# EAGLE schematic VS1053 hardware (EAGLE 9.3.2)
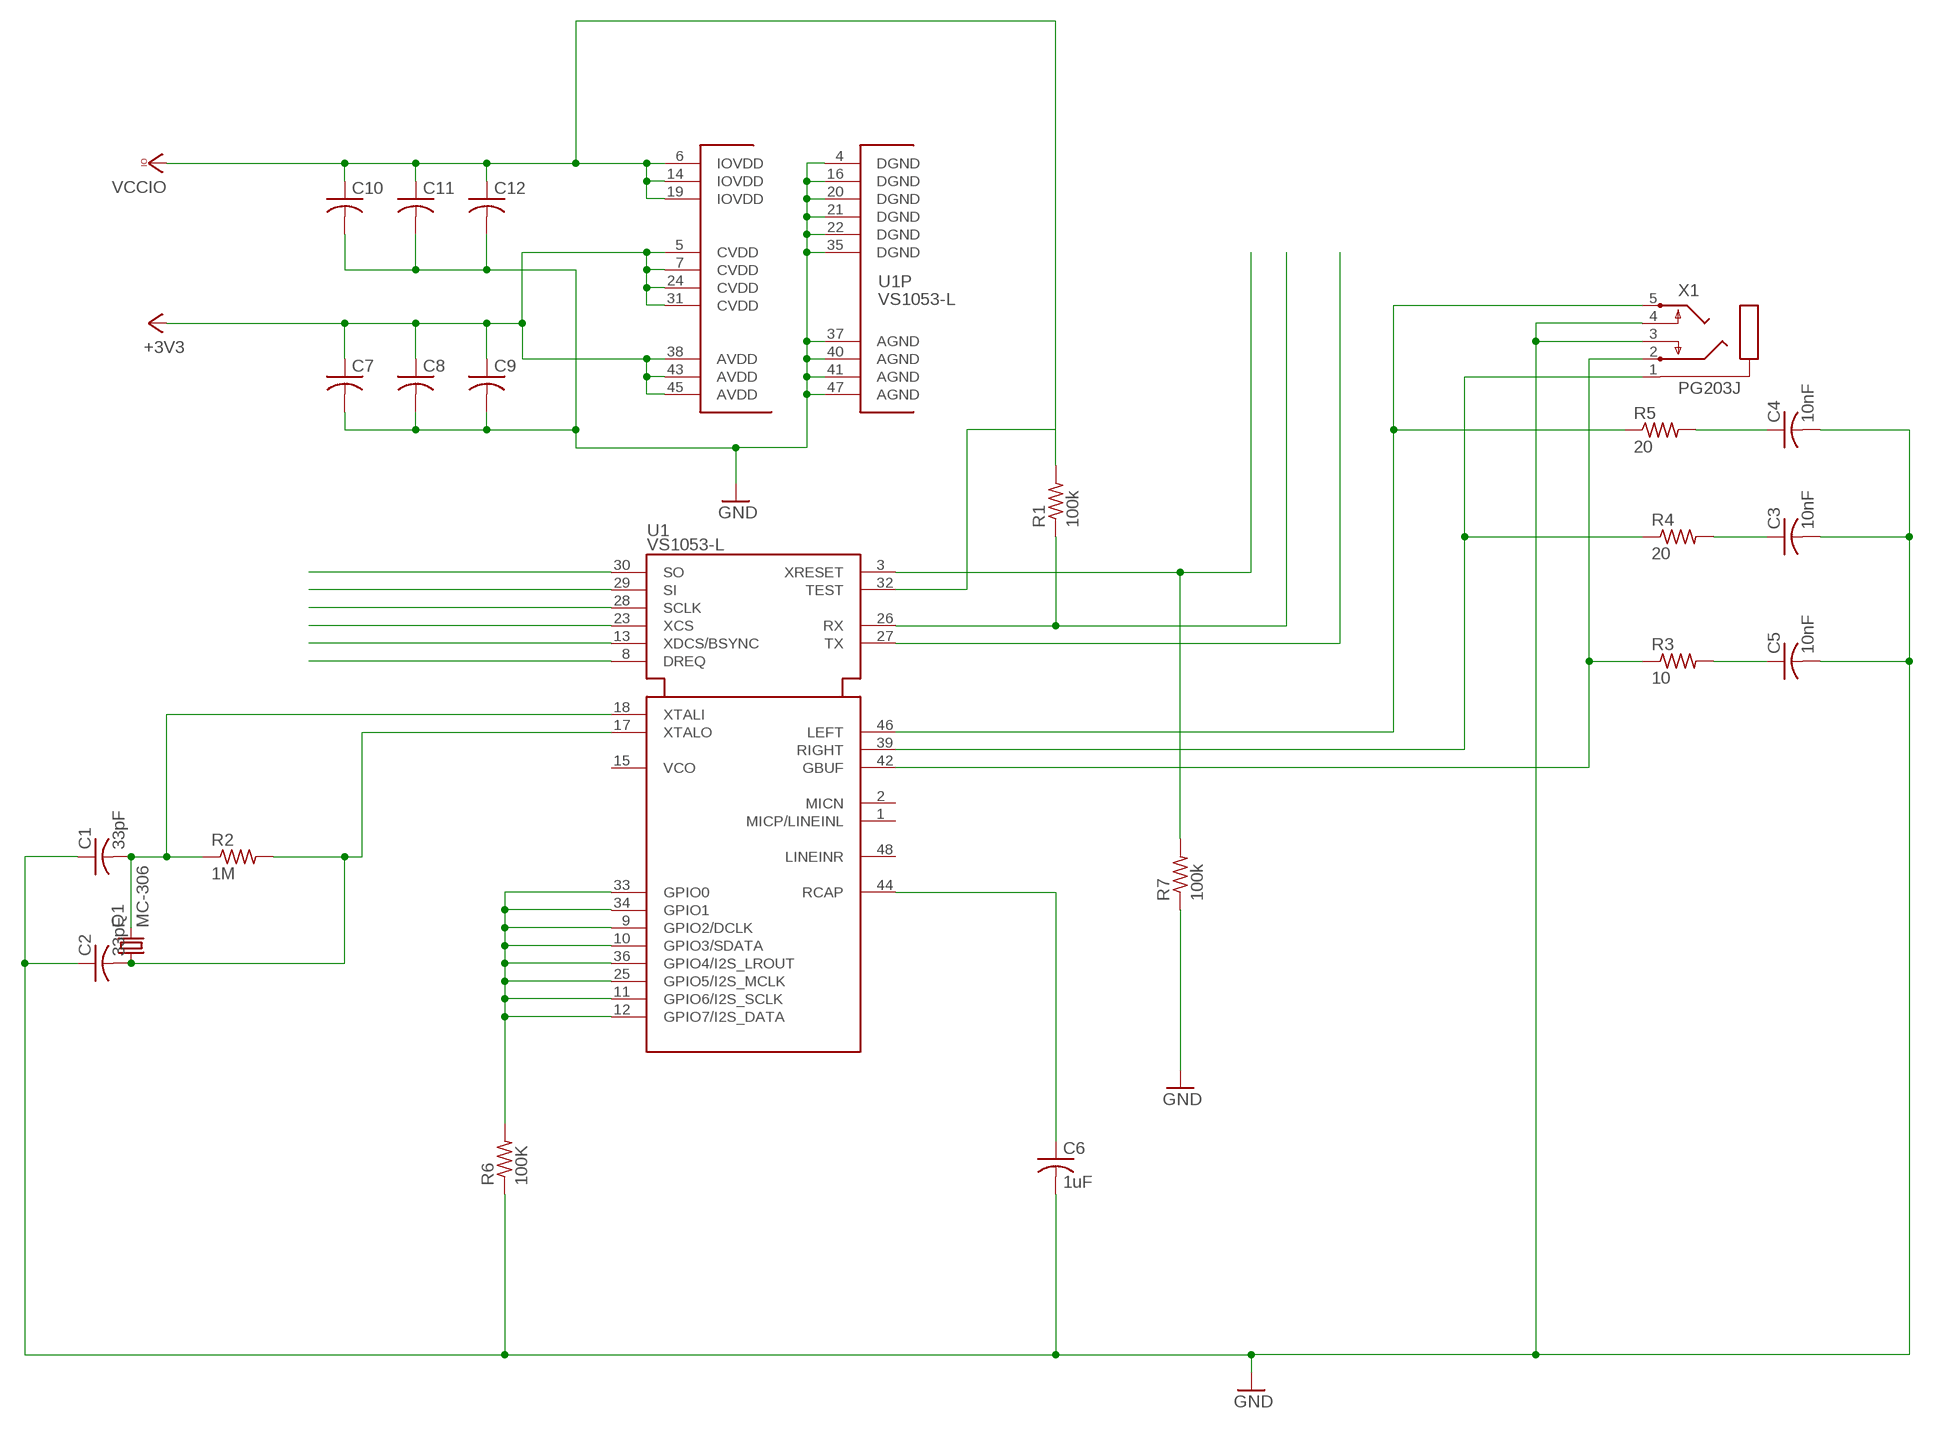
[diagram p0: schematic, sheet 1]

## Parts
C1  33pF  C-USC0402  [C0402]
C2  33pF  C-USC0402  [C0402]
C3  10nF  C-USC0201  [C0201]
C4  10nF  C-USC0201  [C0201]
C5  10nF  C-USC0201  [C0201]
C6  1uF  C-USC0201  [C0201]
C7  C-USC0504  [C0504]
C8  C-USC0504  [C0504]
C9  C-USC0504  [C0504]
C10  C-USC0504  [C0504]
C11  C-USC0504  [C0504]
C12  C-USC0504  [C0504]
Q1  MC-306  [MC-306]
R1  100k  R-US_M0805  [M0805]
R2  1M  R-US_1812X7R  [1812X7R]
R3  10  R-US_01005  [R01005]
R4  20  R-US_01005  [R01005]
R5  20  R-US_01005  [R01005]
R6  100K  R-US_M0805  [M0805]
R7  100k  R-US_M0805  [M0805]
U1  VS1053-L  [LQFP48]
X1  PG203J  [PG203J]

## Nets
+3V3: C7.1 C8.1 C9.1 U1.5(CVDD) U1.7(CVDD) U1.24(CVDD) U1.31(CVDD) U1.38(AVDD) U1.43(AVDD) U1.45(AVDD)
GND: C1.1 C2.1 C3.2 C4.2 C5.2 C6.2 C7.2 C8.2 C9.2 C10.2 C11.2 C12.2 R6.1 R7.1 U1.4(DGND) U1.16(DGND) U1.20(DGND) U1.21(DGND) U1.22(DGND) U1.35(DGND) U1.37(AGND) U1.40(AGND) U1.41(AGND) U1.47(AGND) X1.3 X1.4
N$1: C1.2 Q1.4 R2.1 U1.18(XTALI)
N$2: C2.2 Q1.1 R2.2 U1.17(XTALO)
N$3: C5.1 R3.2
N$4: C6.1 U1.44(RCAP)
N$5: R3.1 U1.42(GBUF) X1.2
N$6: R4.1 U1.39(RIGHT) X1.1
N$7: R5.1 U1.46(LEFT) X1.5
N$8: C3.1 R4.2
N$9: C4.1 R5.2
N$10: U1.28(SCLK)
N$11: R6.2 U1.9(GPIO2/DCLK) U1.10(GPIO3/SDATA) U1.11(GPIO6/I2S_SCLK) U1.12(GPIO7/I2S_DATA) U1.25(GPIO5/I2S_MCLK) U1.33(GPIO0) U1.34(GPIO1) U1.36(GPIO4/I2S_LROUT)
N$12: U1.23(XCS)
N$13: R1.1 U1.26(RX)
N$14: U1.13(XDCS/BSYNC)
N$15: R7.2 U1.3(XRESET)
N$16: U1.8(DREQ)
N$17: U1.30(SO)
N$18: U1.29(SI)
N$19: U1.27(TX)
VCCIO: C10.1 C11.1 C12.1 R1.2 U1.6(IOVDD) U1.14(IOVDD) U1.19(IOVDD) U1.32(TEST)
Unconnected: U1.1(MICP/LINEINL) U1.2(MICN) U1.15(VCO) U1.48(LINEINR)

## Library data of the parts
C1-C12 = rcl:C-US: CAPACITOR, American symbol; SPICEPREFIX: C
Q1 = crystal:MC-306: kHz RANGE CRYSTAL UNIT SMD Source: MC-306_405_406_E07X.PDF Homepage <http://www.epsontoyocom.co.jp>; MPN: MC-306 60.0KHZ 100PPM ,12.5PF; OC_FARNELL: 1278040; OC_NEWARK: 31M5576
R1-R7 = rcl:R-US_: RESISTOR, American symbol; SPICEPREFIX: R
U1 = vlsi-web-e7:VS1053: Ogg Vorbis / MP3 / AAC / WMA / FLAC / MIDI Audio Codec Chip
X1 = con-hirschmann:PG203J: MIC/HEADPHONE JACK KS-S stereo microphone/headphone jack PG203JN (Schukat); OC_FARNELL: unknown; OC_NEWARK: unknown